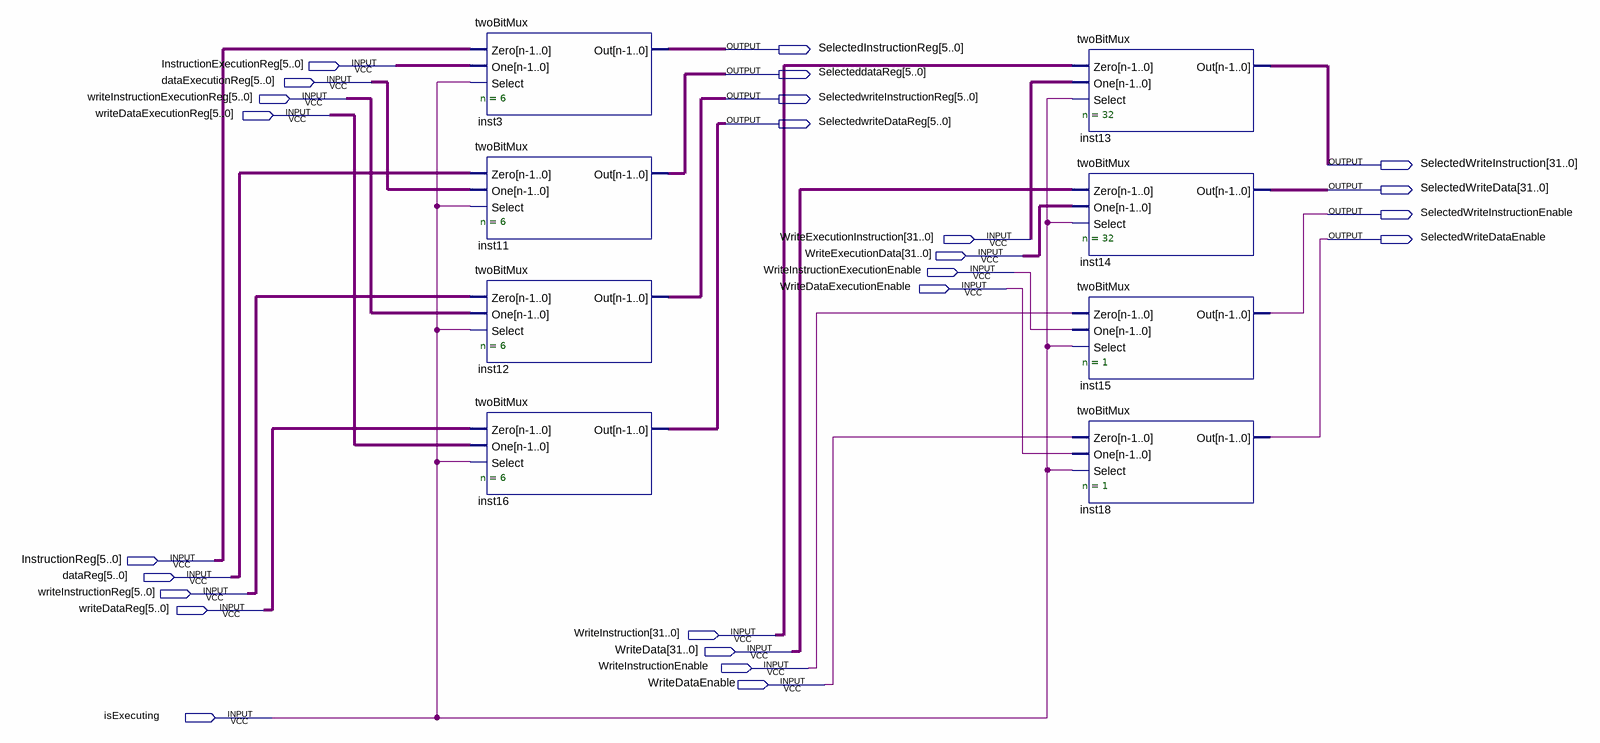
[diagram p0: schematic sheet]
// Quartus schematic MemoryPortsSelector.bdf as structural Verilog: 8 symbols, 25 pins
module MemoryPortsSelector (
  input  [5:0] InstructionExecutionReg,
  input  [5:0] dataExecutionReg,
  input  [5:0] writeInstructionExecutionReg,
  input  [5:0] writeDataExecutionReg,
  input  [31:0] WriteExecutionInstruction,
  input  [31:0] WriteExecutionData,
  input  WriteInstructionExecutionEnable,
  input  WriteDataExecutionEnable,
  input  [5:0] InstructionReg,
  input  [5:0] dataReg,
  input  [5:0] writeInstructionReg,
  input  [5:0] writeDataReg,
  input  [31:0] WriteInstruction,
  input  [31:0] WriteData,
  input  WriteInstructionEnable,
  input  WriteDataEnable,
  input  isExecuting,
  output [5:0] SelectedInstructionReg,
  output [5:0] SelecteddataReg,
  output [5:0] SelectedwriteInstructionReg,
  output [5:0] SelectedwriteDataReg,
  output [31:0] SelectedWriteInstruction,
  output [31:0] SelectedWriteData,
  output SelectedWriteInstructionEnable,
  output SelectedWriteDataEnable
);

  twoBitMux #(.n(6)) inst3 (
    .Zero(InstructionReg), .One(InstructionExecutionReg), .Select(isExecuting), .Out(SelectedInstructionReg));
  twoBitMux #(.n(6)) inst11 (.Zero(dataReg), .One(dataExecutionReg), .Select(isExecuting), .Out(SelecteddataReg));
  twoBitMux #(.n(6)) inst12 (
    .Zero(writeInstructionReg), .One(writeInstructionExecutionReg), .Select(isExecuting),
    .Out(SelectedwriteInstructionReg));
  twoBitMux #(.n(6)) inst16 (
    .Zero(writeDataReg), .One(writeDataExecutionReg), .Select(isExecuting), .Out(SelectedwriteDataReg));
  twoBitMux #(.n(32)) inst13 (
    .Zero(WriteInstruction), .One(WriteExecutionInstruction), .Select(isExecuting),
    .Out(SelectedWriteInstruction));
  twoBitMux #(.n(32)) inst14 (
    .Zero(WriteData), .One(WriteExecutionData), .Select(isExecuting), .Out(SelectedWriteData));
  twoBitMux #(.n(1)) inst15 (
    .Zero(WriteInstructionEnable), .One(WriteInstructionExecutionEnable), .Select(isExecuting),
    .Out(SelectedWriteInstructionEnable));
  twoBitMux #(.n(1)) inst18 (
    .Zero(WriteDataEnable), .One(WriteDataExecutionEnable), .Select(isExecuting),
    .Out(SelectedWriteDataEnable));
endmodule
